# Altium schematic sheet PWR_AFE.SchDoc
size A; SheetNumber: 7; SheetTotal: 7
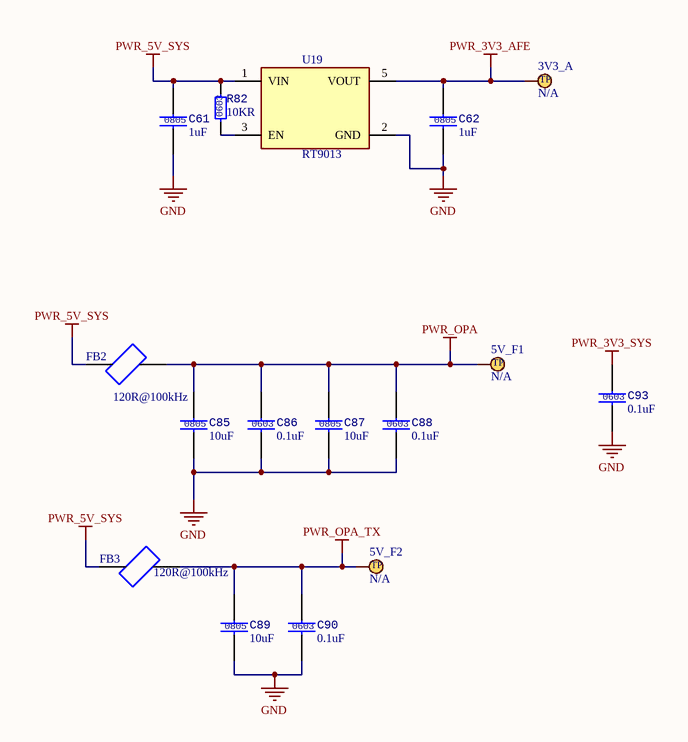
[diagram p0: PWR_AFE.SchDoc]

## Parts
3V3_A  TEST_POINT  [Test_point]  (value not drawn)
5V_F1  TEST_POINT  [Test_point]  (value not drawn)
5V_F2  TEST_POINT  [Test_point]  (value not drawn)
C61  Size: 0805  [CAPCER 0805 SMD]  (hidden comment: 1uF)
C62  Size: 0805  [CAPCER 0805 SMD]  (hidden comment: 1uF)
C85  Size: 0805  [CAPCER 0805 SMD]  (hidden comment: 10uF)
C86  Size: 0603  [CAPCER 0805 SMD]  (hidden comment: 0.1uF)
C87  Size: 0805  [CAPCER 0805 SMD]  (hidden comment: 10uF)
C88  Size: 0603  [CAPCER 0805 SMD]  (hidden comment: 0.1uF)
C89  Size: 0805  [CAPCER 0805 SMD]  (hidden comment: 10uF)
C90  Size: 0603  [CAPCER 0805 SMD]  (hidden comment: 0.1uF)
C93  Size: 0603  [CAPCER 0805 SMD]  (hidden comment: 0.1uF)
FB2  120R@100kHz  [FB 0805]
FB3  120R@100kHz  [FB 0805]
R82  Size: 0603  [RESC 0603(1608) SMD]  (hidden comment: 10KR)
U19  RT9013  [SOT-23-5]

## Nets
GND: C61.2 C62.2 C85.2 C86.2 C87.2 C88.2 C89.2 C90.2 C93.2 U19.2(GND)
PWR_3V3_AFE: 3V3_A.1 C62.1 U19.5(VOUT)
PWR_3V3_SYS: C93.1
PWR_5V_SYS: C61.1 FB2.1 FB3.1 R82.2 U19.1(VIN)
PWR_OPA: 5V_F1.1 C85.1 C86.1 C87.1 C88.1 FB2.2
PWR_OPA_TX: 5V_F2.1 C89.1 C90.1 FB3.2
NetR82_1: R82.1 U19.3(EN)

## Notes on the sheet
- (in symbol DB-0034) TP

## Library data of the parts
3V3_A 5V_F1 5V_F2 = DB-0034: Value: N/A; Design Item ID: DB-0034; Power Rate: N/A; Tolerance: N/A; Footprint Type: PAD; Size: PAD
C61 C62 = DB-0063: CAPACITOR SMD 1uF 16V 10% 0805; Value: 1uF; Design Item ID: DB-0063; Type: CAPACITOR; Power Rate: N/A; Tolerance: 10%; Footprint Type: SMD; Supplier: THEGIOIIC; Supplier Part Number: Tụ Gốm 0805 1uF 16V; Supplier Link: https://www.thegioiic.com/tu-gom-0805-1uf-16v
C85 C87 C89 = DB-0018: CAPACITOR SMD 10uF 25V 10% 0805; Design Item ID: DB-0018; Value: 10uF; Type: CAPACITOR; Power Rate: N/A; Tolerance: 10%; Footprint Type: SMD; Supplier: THEGIOIIC; Supplier Part Number: Tụ Gốm 0805 10uF 25V; Supplier Link: https://www.thegioiic.com/tu-gom-0805-10uf-25v
C86 C88 C90 C93 = DB-0017: CAPACITOR SMD 0.1uF 50V 10% 0603; Design Item ID: DB-0017; Value: 0.1uF; Type: CAPACITOR; Power Rate: N/A; Tolerance: 10%; Footprint Type: SMD; Supplier: THEGIOIIC; Supplier Part Number: Tụ Gốm 0603 100nF (0.1uF) 25V; Supplier Link: https://www.thegioiic.com/tu-gom-0603-100nf-0-1uf-25v
FB2 FB3 = DB-0076: CBW201209U121T Ferrite Beads 2A 120 Ohm 0805; Design Item ID: DB-0076; Value: 120R@100kHz; Type: FERRITE BEADS; Power Rate: N/A; Tolerance: N/A; Footprint Type: SMD; Size: 0805; Supplier: THEGIOIIC; Supplier Part Number: CBW201209U121T Ferrite Beads 2A 120 Ohm 0805; Supplier Link: https://www.thegioiic.com/cbw201209u121t-ferrite-beads-2a-120-ohm-0805
R82 = DB-0003: RESISTOR SMD 10KR OHM 1% 100mW 0603; Power Rate: 100mW; Value: 10KR; Design Item ID: DB-0003; Type: RESISTOR; Tolerance: 1%; Footprint Type: SMD; Supplier: THEGIOIIC; Supplier Part Number: Điện Trở 10 KOhm 0603 1%; Supplier Link: https://www.thegioiic.com/dien-tro-10-kohm-0603-1-
U19 = DB-0062: IC REG LINEAR 3.3V 500MA SOT23-5; Value: RT9013; Design Item ID: DB-0062; Type: IC; Power Rate: N/A; Tolerance: N/A; Footprint Type: SMD; Size: SOT-23-5; Supplier: THEGIOIIC; Supplier Part Number: RT9013-33GB IC Ổn Áp 3.3V 500mA SOT-23-5; Supplier Link: https://www.thegioiic.com/rt9013-33gb-ic-on-ap-3-3v-500ma-sot-23-5